# EAGLE design AirSensor (EAGLE 9.6.2)
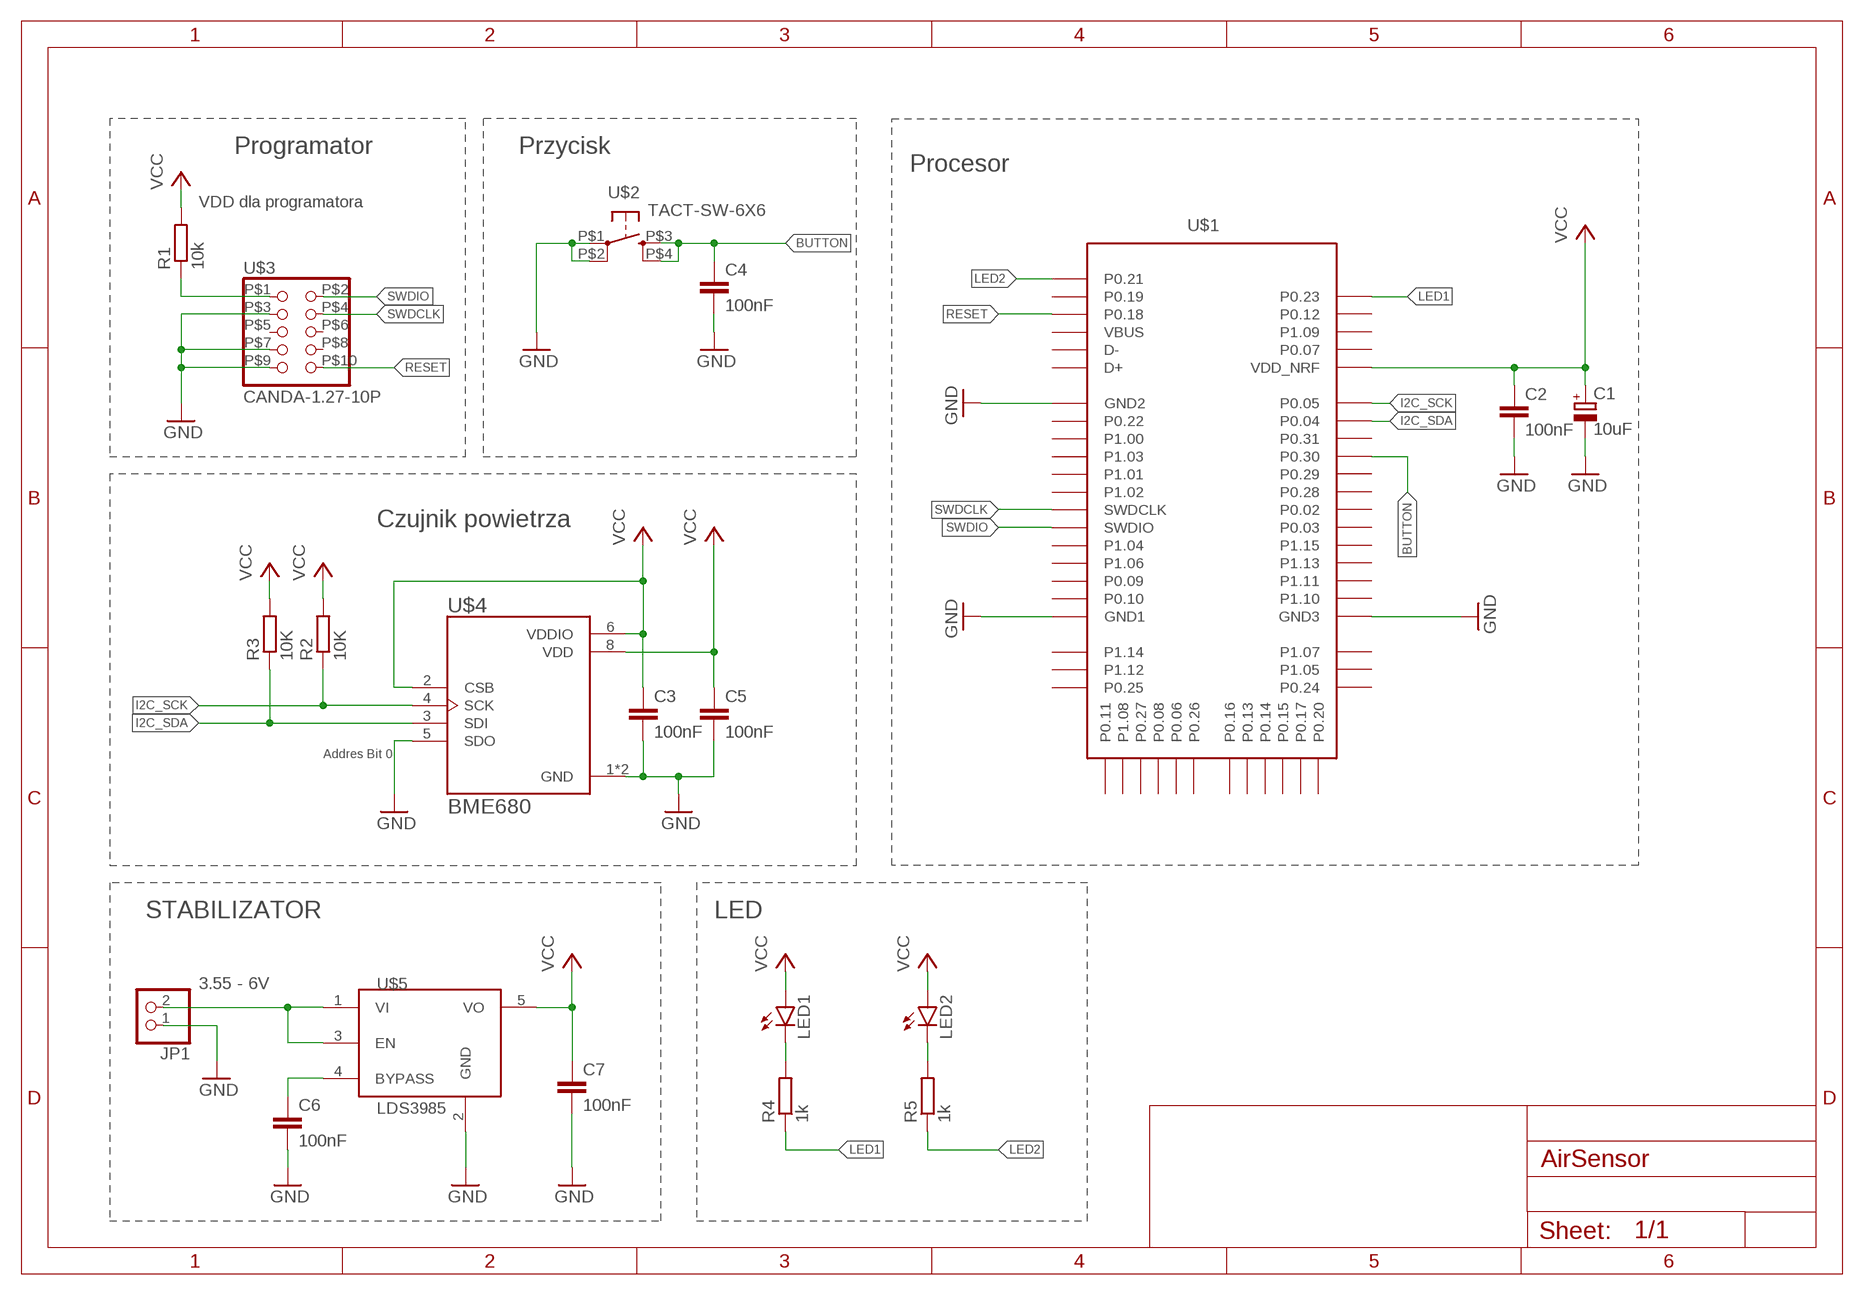
[diagram p0: schematic, sheet 1]

## Parts
C1  10uF  CPOL-EUCT6032  [CT6032]
C2  100nF  C-EUC0805K  [C0805K]
C3  100nF  C-EUC0805K  [C0805K]
C4  100nF  C-EUC0805K  [C0805K]
C5  100nF  C-EUC0805K  [C0805K]
C6  100nF  C-EUC0805K  [C0805K]
C7  100nF  C-EUC0805K  [C0805K]
JP1  PINHD-1X2  [1X02]
LED1  LEDCHIPLED_0603  [CHIPLED_0603]
LED2  LEDCHIPLED_0603  [CHIPLED_0603]
R1  10k  R-EU_R0603  [R0603]
R2  10K  R-EU_R0603  [R0603]
R3  10K  R-EU_R0603  [R0603]
R4  1k  R-EU_R0603  [R0603]
R5  1k  R-EU_R0603  [R0603]
U$1  HOLYIOT_18010  [PCBCOMPONENT_1]
U$2  TACT-SW-6X6  [6X6-TACT-SWITCH-SMD]
U$3  CANDA-1.27-10P  [CON-1.27-CANDA]
U$4  BME680  [PSON80P300X300X100-8N]
U$5  LDS3985  [SOT23-5]

## Nets
BUTTON: C4.1 U$1.P0.30 U$2.P$3(S) U$2.P$4(S1)
GND: C1.- C2.2 C3.2 C4.2 C5.2 C6.2 C7.2 JP1.1 U$1.GND1(GND2) U$1.GND2(GND3) U$1.GND(GND1) U$2.P$1(P) U$2.P$2(P1) U$3.P$3 U$3.P$7 U$3.P$9 U$4.1(GND) U$4.5(SDO) U$4.7(GND) U$5.2(GND)
I2C_SCK: R2.1 U$1.P0.05 U$4.4(SCK)
I2C_SDA: R3.1 U$1.P0.04 U$4.3(SDI)
LED1: R4.1 U$1.P0.23
LED2: R5.1 U$1.P0.21
N$1: R1.1 U$3.P$1
N$2: JP1.2 U$5.1(VI) U$5.3(EN)
N$4: C6.1 U$5.4(BYPASS)
N$5: LED1.C R4.2
N$7: LED2.C R5.2
RESET: U$1.P0.18 U$3.P$10
SWDCLK: U$1.SWDCLK U$3.P$4
SWDIO: U$1.SWDIO U$3.P$2
VCC: C1.+ C2.1 C3.1 C5.1 C7.1 LED1.A LED2.A R1.2 R2.2 R3.2 U$1.VDD_NRF U$4.2(CSB) U$4.6(VDDIO) U$4.8(VDD) U$5.5(VO)
Unconnected: U$1.D+ U$1.D- U$1.P0.02 U$1.P0.03 U$1.P0.06 U$1.P0.07 U$1.P0.08 U$1.P0.09 U$1.P0.10 U$1.P0.11 U$1.P0.12 U$1.P0.13 U$1.P0.14 U$1.P0.15 U$1.P0.16 U$1.P0.17 U$1.P0.19 U$1.P0.20 U$1.P0.22 U$1.P0.24 U$1.P0.25 U$1.P0.26 U$1.P0.27 U$1.P0.28 U$1.P0.29 U$1.P0.31 U$1.P1.00 U$1.P1.01 U$1.P1.02 U$1.P1.03 U$1.P1.04 U$1.P1.05 U$1.P1.06 U$1.P1.07 U$1.P1.08 U$1.P1.09 U$1.P1.10 U$1.P1.11 U$1.P1.12 U$1.P1.13 U$1.P1.14 U$1.P1.15 U$1.VBUS U$3.P$5 U$3.P$6 U$3.P$8

## Notes on the sheet
- Programator | Przycisk
- Procesor
- VDD dla programatora
- Czujnik powietrza
- Addres Bit 0
- STABILIZATOR | LED
- 3.55 - 6V

## Library data of the parts
C1 = rcl:CPOL-EU: POLARIZED CAPACITOR, European symbol; SPICEPREFIX: C
C2-C7 = rcl:C-EU: CAPACITOR, European symbol; SPICEPREFIX: C
JP1 = Inrzynierka:PINHD-1X2: PIN HEADER
LED1 LED2 = Inrzynierka:LED: LED OSRAM: - CHIPLED LG R971, LG N971, LY N971, LG Q971, LY Q971, LO R971, LY R971 LH N974, LH R974 LS Q976, LO Q976, LY Q976 LO Q996 - Hyper CHIPLED LW Q18S LB Q993, LB Q99A, LB R99A - SideLED LS A670, LO A670, LY A670, LG A670, LP A670 LB A673, LV A673, LT A673, LW A673 LH A674 LY A675 LS A676, LA A676, LO A676, LY A676, LW A676 LS A679, LY A679, LG A679 - Hyper Micro SIDELED® LS Y876, LA Y876, LO Y876, LY Y876 LT Y87S - SmartLED LW L88C, LW L88S LB L89C, LB L89S, LG L890 LS L89K, LO L89K, LY L89K LS L896, LA L896, LO L896, LY L896 - TOPLED LS T670, LO T670, LY T670, LG T670, LP T670 LSG T670, LSP T670, LSY T670, LOP T670, LYG T670 LG T671, LOG T671, LSG T671 LB T673, LV T673, LT T673, LW T673 LH T674 LS T676, LA T676, LO T676, LY T676, LB T676, LH T676, LSB T676, LW T676 LB T67C, LV T67C, LT T67C, LS T67K, LO T67K, LY T67K, LW E67C LS E67B, LA E67B, LO E67B, LY E67B, LB E67C, LV E67C, LT E67C LW T67C LS T679, LY T679, LG T679 LS T770, LO T770, LY T770, LG T770, LP T770 LB T773, LV T773, LT T773, LW T773 LH T774 LS E675, LA E675, LY E675, LS T675 LS T776, LA T776, LO T776, LY T776, LB T776 LHGB T686 LT T68C, LB T68C - Hyper Mini TOPLED® LB M676 - Mini TOPLED Santana® LG M470 LS M47K, LO M47K, LY M47K Source: http://www.osram.convergy.de LUXEON: - LUMILED® LXK2-PW12-R00, LXK2-PW12-S00, LXK2-PW14-U00, LXK2-PW14-V00 LXK2-PM12-R00, LXK2-PM12-S00, LXK2-PM14-U00 LXK2-PE12-Q00, LXK2-PE12-R00, LXK2-PE12-S00, LXK2-PE14-T00, LXK2-PE14-U00 LXK2-PB12-K00, LXK2-PB12-L00, LXK2-PB12-M00, LXK2-PB14-N00, LXK2-PB14-P00, LXK2-PB14-Q00 LXK2-PR12-L00, LXK2-PR12-M00, LXK2-PR14-Q00, LXK2-PR14-R00 LXK2-PD12-Q00, LXK2-PD12-R00, LXK2-PD12-S00 LXK2-PH12-R00, LXK2-PH12-S00 LXK2-PL12-P00, LXK2-PL12-Q00, LXK2-PL12-R00 Source: www.luxeon.com KINGBRIGHT: KA-3528ASYC Source: www.kingbright.com
R1-R5 = rcl:R-EU_: RESISTOR, European symbol; SPICEPREFIX: R
U$1 = Inrzynierka:HOLYIOT_18010
U$2 = Inrzynierka:TACT-SW-6X6
U$3 = Inrzynierka:CANDA-1.27-10P
U$4 = Inrzynierka:BME680: Integrated Environmental Unit Check prices <https://pricing.snapeda.com/parts/BME680/Bosch%20Sensortec/view-part?ref=eda>; AVAILABILITY: In Stock; DESCRIPTION: Pressure,Temperature and Humidity Sensor Digital Output 1.8V 8-Pin LGA; MF: Bosch Sensortec; MP: BME680; PACKAGE: LGA-8 Bosch Tools; PRICE: None; PURCHASE-URL: https://pricing.snapeda.com/search/part/BME680/?ref=eda
U$5 = Inrzynierka:LDS3985

## Board
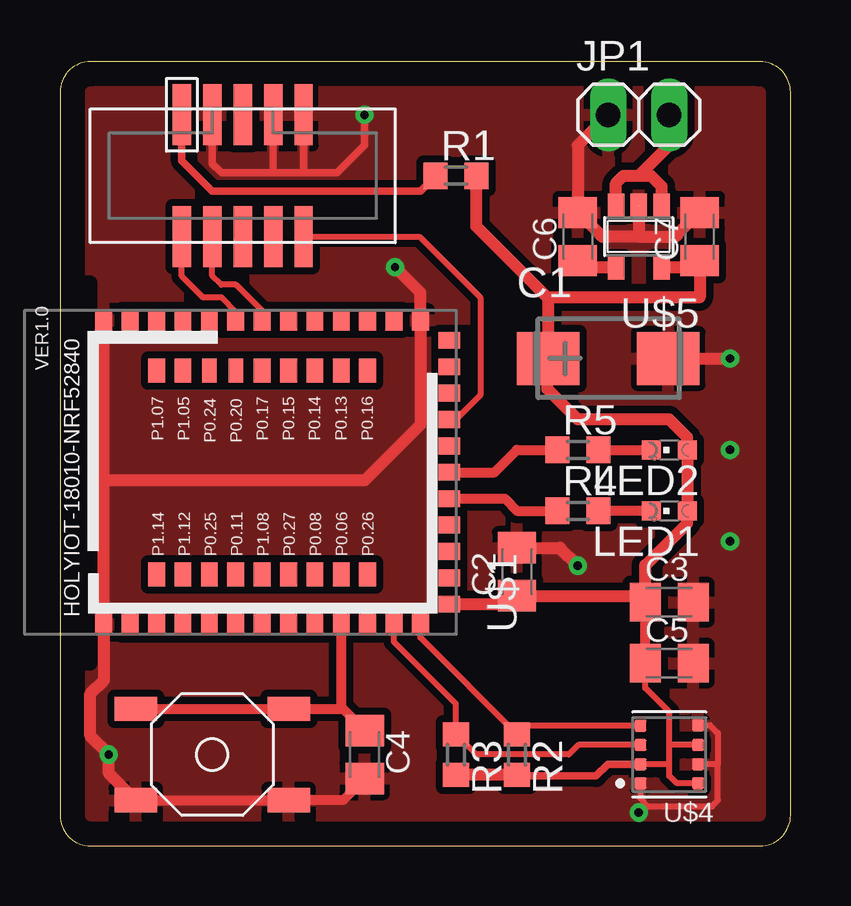
[diagram p1: board, top side]
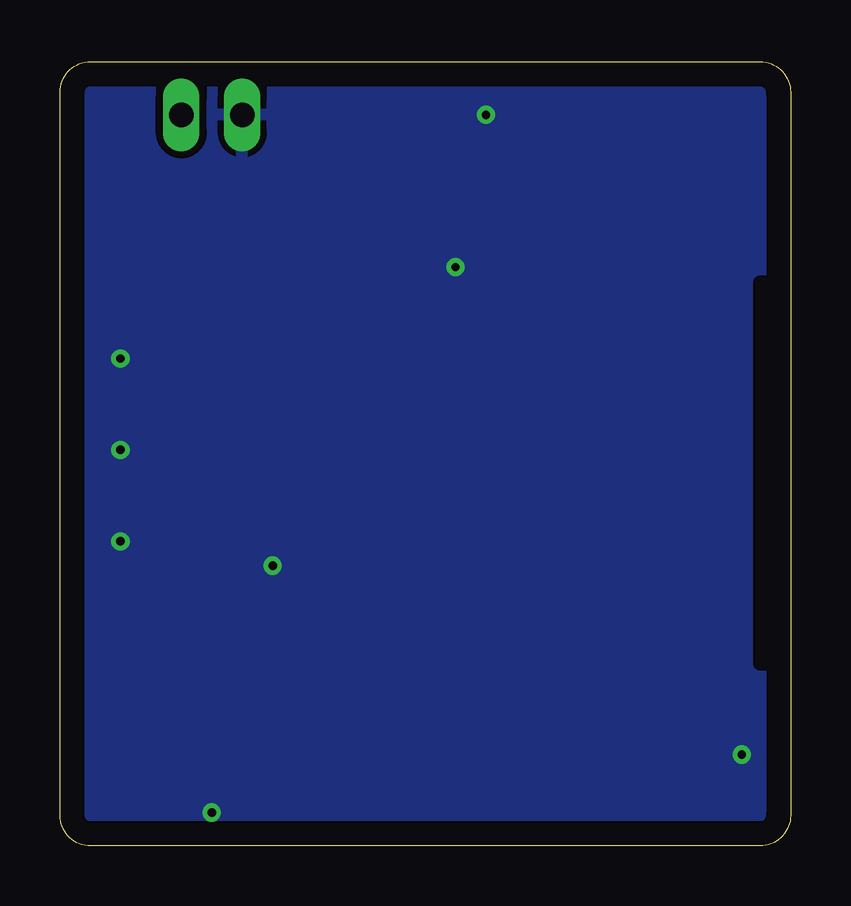
[diagram p2: board, bottom side, seen from below]

Size 30.46 x 32.69 mm. Coordinates in mm from the lower left corner, seen from the top.
Outline: 0,31.42 0,1.27 arc90 1.27,0 29.19,0 arc90 30.46,1.27 30.46,31.42 arc90 29.19,32.69 1.27,32.69 arc90 0,31.42
Copper layers (1*16): Top 0.035mm / dielectric 1.5mm / Bottom 0.035mm
Design rules "default": minimum track width 6mil, minimum drill 0.35mm, track to track 6mil, track to pad 6mil, pad to pad 6mil, via to via 6mil, smd to smd 6mil, copper to edge 40mil, drill to drill 6mil, minimum pad ring 10mil, minimum via ring 8mil, stop-mask expansion 4mil, vias tented up to drill 0mil, thermal gap 10mil

### Footprints (pad centres in the part's own frame; a part is rotated, then mirrored left to right if it is on the bottom)
CT6032 = smd 2.6 x 2.2: + -2.5,0; - 2.5,0
C0805K = smd 1.3 x 1.6: 1 -1,0; 2 1,0
1X02 = drill 1.016 long: 1 -1.27,0; 2 1.27,0
CHIPLED_0603 = smd 0.8 x 0.8: A 0,-0.75; C 0,0.75
R0603 = smd 1 x 1.1: 1 -0.85,0; 2 0.85,0
PCBCOMPONENT_1 = smd 0.7 x 0.9: D+ 5.837,-7.336; D- 4.737,-7.336; P0.07 -4.063,-7.336; P0.12 -1.863,-7.336; P0.18 2.537,-7.336; P0.19 1.437,-7.336; P0.21 0.337,-7.336; P0.23 -0.763,-7.336; P1.09 -2.963,-7.336; VBUS 3.637,-7.336; VDD_NRF -5.163,-7.336 | smd 0.9 x 0.7: GND -6.013,7.064; GND1 6.687,-6.136; GND2 6.687,7.064; P0.02 -6.013,0.464; P0.03 -6.013,1.564; P0.04 -6.013,-5.036; P0.05 -6.013,-6.136; P0.09 6.687,4.864; P0.10 6.687,5.964; P0.22 6.687,-5.036; P0.28 -6.013,-0.636; P0.29 -6.013,-1.736; P0.30 -6.013,-2.836; P0.31 -6.013,-3.936; P1.00 6.687,-3.936; P1.01 6.687,-1.736; P1.02 6.687,-0.636; P1.03 6.687,-2.836; P1.04 6.687,2.664; P1.06 6.687,3.764; P1.10 -6.013,4.864; P1.11 -6.013,5.964; P1.13 -6.013,3.764; P1.15 -6.013,2.664; SWDCLK 6.687,0.464; SWDIO 6.687,1.564 | smd 1 x 0.7: P0.06 -3.913,-2.836; P0.08 -3.913,-1.736; P0.11 -3.913,1.564; P0.13 4.587,-2.836; P0.14 4.587,-1.736; P0.15 4.587,-0.636; P0.16 4.587,-3.936; P0.17 4.587,0.464; P0.25 -3.913,2.664; P0.26 -3.913,-3.936; P0.27 -3.913,-0.636; P1.05 4.587,3.764; P1.07 4.587,4.864; P1.08 -3.913,0.464; P1.12 -3.913,3.764; P1.14 -3.913,4.864 | smd 1 x 0.6: P0.20 4.587,1.564; P0.24 4.587,2.664
6X6-TACT-SWITCH-SMD = smd 1.778 x 1.016: P$1 -3.188,-1.905; P$2 3.188,-1.905; P$3 -3.188,1.905; P$4 3.188,1.905
CON-1.27-CANDA = smd 0.762 x 2.54: P$1 2.54,-2.54; P$2 2.54,2.54; P$3 1.27,-2.54; P$4 1.27,2.54; P$5 0,-2.54; P$6 0,2.54; P$7 -1.27,-2.54; P$8 -1.27,2.54; P$9 -2.54,-2.54; P$10 -2.54,2.54
PSON80P300X300X100-8N = smd 0.5 x 0.5: 1 1.2,1.2; 2 1.2,0.4; 3 1.2,-0.4; 4 1.2,-1.2; 5 -1.2,-1.22; 6 -1.2,-0.4; 7 -1.2,0.4; 8 -1.2,1.2
SOT23-5 = smd 0.69 x 0.99: 1 -0.95,-1.29; 2 0,-1.29; 3 0.95,-1.29; 4 0.95,1.3; 5 -0.95,1.3

### Placement (x,y rotation side)
C1  22.86,20.32 0 top
C2  19.05,11.43 90 top
C3  25.4,10.16 0 top
C4  12.7,3.81 270 top
C5  25.4,7.62 0 top
C6  21.59,25.4 90 top
C7  26.67,25.4 90 top
JP1  24.13,30.48 0 top
LED1  25.4,13.97 90 top
LED2  25.4,16.51 90 top
R1  16.51,27.94 0 top
R2  19.05,3.81 270 top
R3  16.51,3.81 270 top
R4  21.59,13.97 0 top
R5  21.59,16.51 0 top
U$1  8.89,15.24 90 top
U$2  6.35,3.81 0 top
U$3  7.62,27.94 180 top
U$4  25.4,3.81 180 top
U$5  24.13,25.4 180 top

### Tracks (layer width: path | path; a pad name or v marks a point on that pad's centre or on a via)
BUTTON
  Top 0.406: U$2.P$3 U$2.P$4 11.79,5.72 | 11.79,5.72 C4.1 | U$1.P0.30 11.73,5.78 11.79,5.72
GND  (via drill 0.35)
  Top 0.254: U$4.5 27.1,5.03 27.43,4.7 27.43,3.43 | U$4.7 27.43,3.41 27.43,1.91 27.18,1.65 24.52,1.65 24.52,1.66 | 24.52,1.66 24.2,1.97 U$4.1 | 24.52,1.66 24.25,1.39 v24.13,1.39
  Top 0.305: U$3.P$3 6.35,28.45 6.73,28.07 8.89,28.07 | 8.89,28.07 10.16,28.07 | 10.16,28.07 11.56,28.07 12.7,29.21 v12.7,30.48 | U$3.P$7 8.89,28.07 | U$3.P$9 10.16,28.07
  Top 0.406: U$2.P$1 U$2.P$2 11.79,1.91 C4.2
  Top 0.508: U$5.2 24.13,25.4 | 22.56,25.46 22.61,25.4 24.13,25.4 | 22.53,25.46 22.56,25.46 | 24.13,25.4 25.64,25.4 25.7,25.46 | 25.73,25.46 25.7,25.46 | JP1.1 21.59,29.21 C6.2 21.61,26.4 22.56,25.46 | 25.7,25.46 26.64,26.4 C7.2 | C2.2 20.84,12.43 v21.59,11.68 | U$2.P$1 2.03,3.04 v2.03,3.81 1.27,4.57 1.27,6.35 1.83,6.91 U$1.GND 1.83,15.24 | C1.- v27.94,20.32 | 1.83,15.24 U$1.GND2 | 1.83,15.24 12.7,15.24 15.03,17.57 U$1.GND1 15.03,23.07 v13.97,24.13
  other vias: 27.94,12.7 27.94,16.51
  pour Top (isolate 0.305): -1.27,33.02 31.75,33.02 31.75,-1.27 -2.54,-1.27 -2.54,33.02
  pour Bottom (isolate 0.305): -3.81,34.29 33.02,34.29 33.02,-2.54 -3.81,-2.54
I2C_SCK
  Top 0.254: U$4.4 19.4,5.01 R2.1 15.03,8.68 U$1.P0.05
I2C_SDA
  Top 0.254: U$4.3 21.61,4.21 21.21,3.81 17.36,3.81 R3.1 16.51,5.93 13.93,8.51 U$1.P0.04
LED1
  Top 0.406: U$1.P0.23 18.54,14.48 19.05,13.97 R4.1
LED2
  Top 0.406: U$1.P0.21 18.12,15.58 19.05,16.51 R5.1
N$1
  Top 0.305: U$3.P$1 5.08,28.57 6.35,27.3 15.03,27.3 R1.1
N$2
  Top 0.508: U$5.3 23.18,27.62 23.5,27.94 24.13,27.94 | U$5.1 25.08,27.5 24.64,27.94 24.13,27.94 | 24.13,27.94 25.4,29.21 JP1.2
N$4
  Top 0.508: U$5.4 21.89,24.1 C6.1
N$5
  Top 0.406: LED1.C R4.2
N$7
  Top 0.406: R5.2 LED2.C
RESET
  Top 0.254: U$3.P$10 14.99,25.4 17.53,22.86 17.53,18.8 16.51,17.78 U$1.P0.18
SWDCLK
  Top 0.254: U$1.SWDCLK 8.43,22.31 7.34,23.39 6.73,23.39 6.35,23.77 U$3.P$4
SWDIO
  Top 0.254: U$1.SWDIO 7.33,22.27 6.73,22.86 5.97,22.86 5.08,23.75 U$3.P$2
VCC
  Top 0.254: U$4.8 25.71,2.61 25.4,2.92 25.4,3.43 | C5.1 24.4,6.59 25.4,5.59 25.4,4.19 | 25.4,3.43 25.4,4.19 | U$4.6 25.42,4.21 25.4,4.19 | U$4.2 24.22,3.43 25.4,3.43
  Top 0.305: U$4.2 22.84,3.41 22.35,2.92 19.09,2.92 R2.2
  Top 0.406: C5.1 C3.1
  Top 0.508: U$5.5 25.11,24.13 26.67,24.13 C7.1 26.67,22.86 20.32,22.86 | 20.32,22.86 17.36,25.82 R1.2 | U$1.VDD_NRF 18.7,10.08 C2.1 24.13,10.43 C3.1 24.4,11.7 26.15,13.45 LED1.A LED2.A 26.15,17.03 25.4,17.78 21.59,17.78 20.32,19.05 20.32,20.28 C1.+ 20.36,22.82 20.32,22.86 | R2.2 R3.2